# EAGLE design PCB-BI8-2x4_PCBAtest (EAGLE 6.5.0)

## Sheet 1 of 2
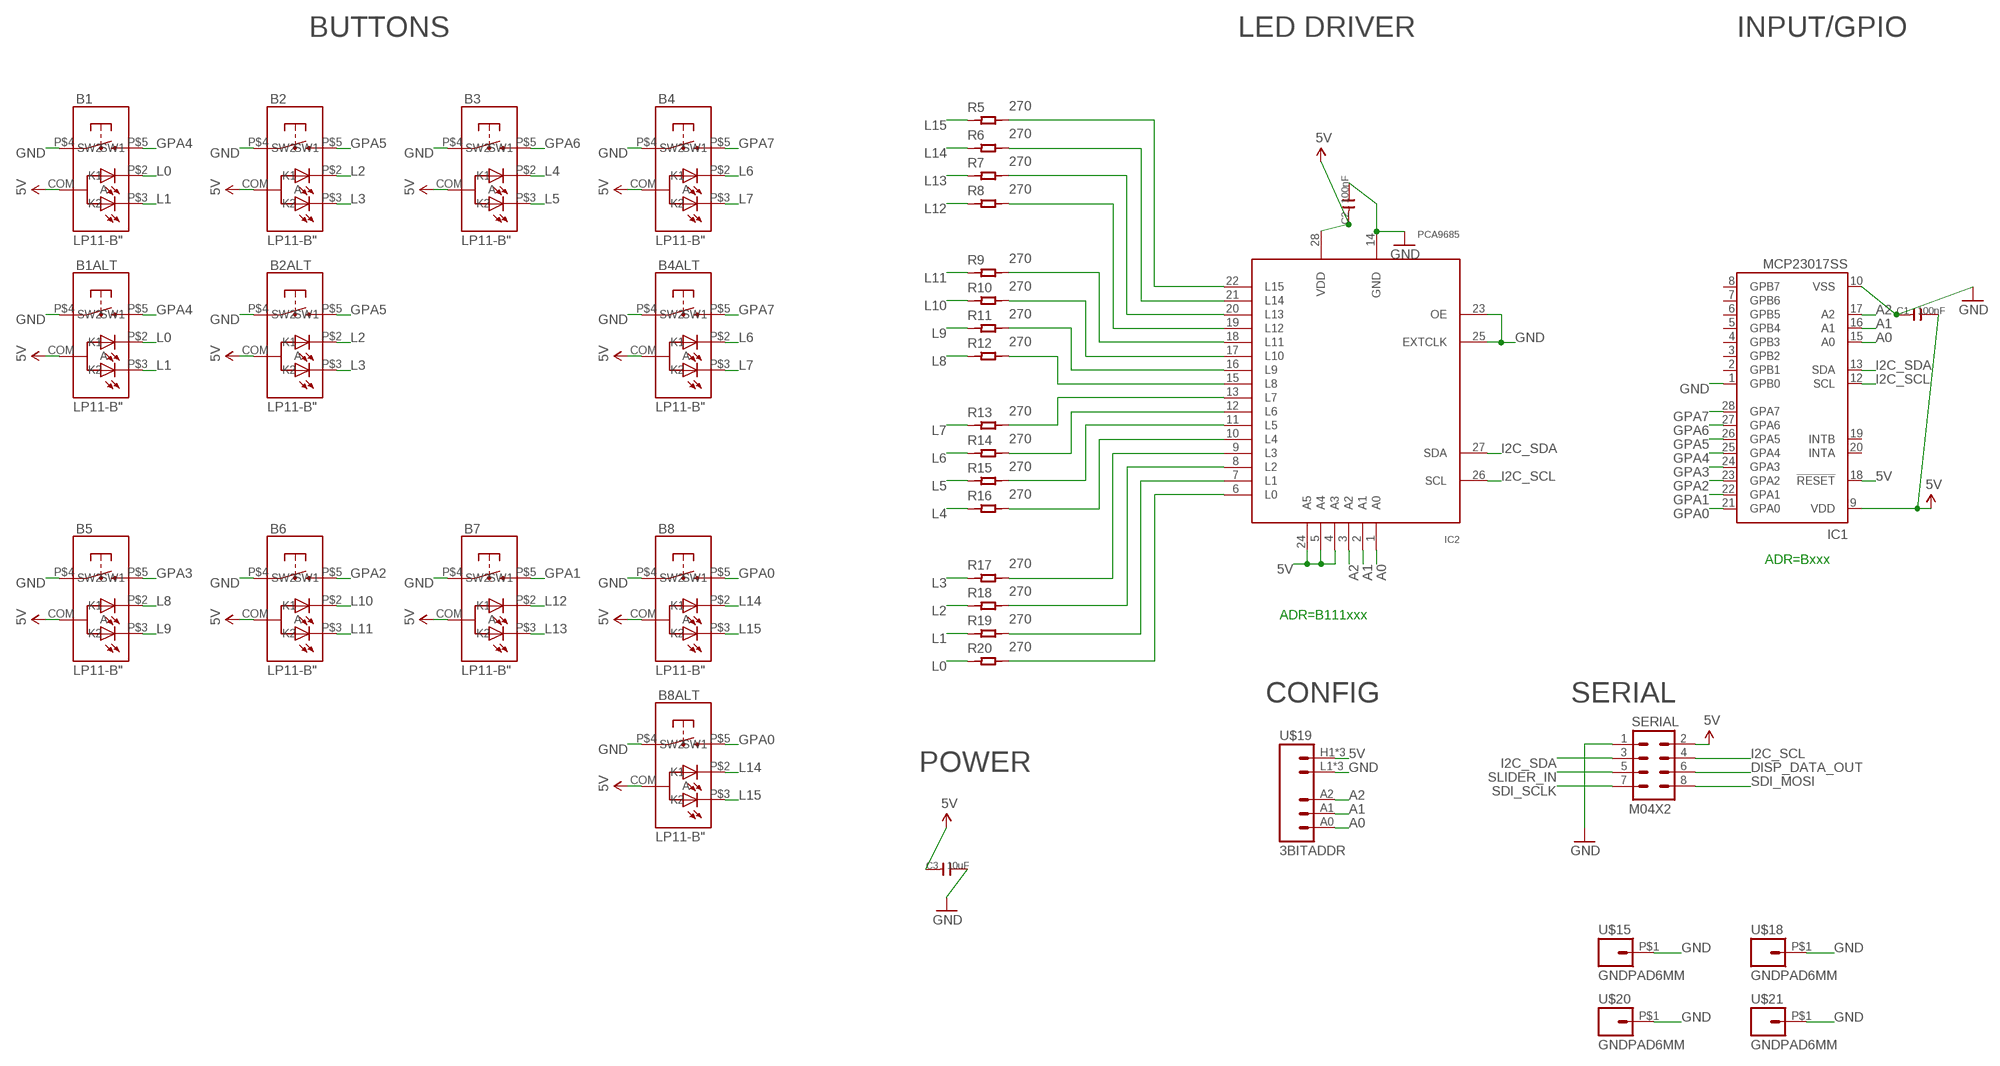
[diagram p0: schematic, sheet 1]

### Parts
B1  LP11-B"  [LP11]
B1ALT  LP11-B"  [LP11]
B2  LP11-B"  [LP11]
B2ALT  LP11-B"  [LP11]
B3  LP11-B"  [LP11]
B4  LP11-B"  [LP11]
B4ALT  LP11-B"  [LP11]
B5  LP11-B"  [LP11]
B6  LP11-B"  [LP11]
B7  LP11-B"  [LP11]
B8  LP11-B"  [LP11]
B8ALT  LP11-B"  [LP11]
C1  100nF  C-0603  [C0603]
C2  100nF  C-0603  [C0603]
C3  10uF  C-0805  [C0805]
IC1  MCP23017SS  [SSOP28]
IC2  PCA9685  [TSSOP28]
R5  270  R-0603  [R0603]
R6  270  R-0603  [R0603]
R7  270  R-0603  [R0603]
R8  270  R-0603  [R0603]
R9  270  R-0603  [R0603]
R10  270  R-0603  [R0603]
R11  270  R-0603  [R0603]
R12  270  R-0603  [R0603]
R13  270  R-0603  [R0603]
R14  270  R-0603  [R0603]
R15  270  R-0603  [R0603]
R16  270  R-0603  [R0603]
R17  270  R-0603  [R0603]
R18  270  R-0603  [R0603]
R19  270  R-0603  [R0603]
R20  270  R-0603  [R0603]
SERIAL  M04X2  [2X4]
U$15  GNDPAD6MM  [3.2MMPAD6MM]
U$18  GNDPAD6MM  [3.2MMPAD6MM]
U$19  3BITADDR  [3BITADDR]
U$20  GNDPAD6MM  [3.2MMPAD6MM]
U$21  GNDPAD6MM  [3.2MMPAD6MM]

### Nets
5V [Power]: B1.COM(A) B1ALT.COM(A) B2.COM(A) B2ALT.COM(A) B3.COM(A) B4.COM(A) B4ALT.COM(A) B5.COM(A) B6.COM(A) B7.COM(A) B8.COM(A) B8ALT.COM(A) C1.2 C2.1 C3.1 IC1.9(VDD) IC1.18(!RESET) IC2.4(A3) IC2.5(A4) IC2.24(A5) IC2.28(VDD) SERIAL.2 U$19.H1(VCC) U$19.H2(VCC) U$19.H3(VCC)
A0: IC1.15(A0) IC2.1(A0) U$19.A0
A1: IC1.16(A1) IC2.2(A1) U$19.A1
A2: IC1.17(A2) IC2.3(A2) U$19.A2
DISP_DATA_OUT: SERIAL.6
GND [Power]: B1.P$4(SW1) B1ALT.P$4(SW1) B2.P$4(SW1) B2ALT.P$4(SW1) B3.P$4(SW1) B4.P$4(SW1) B4ALT.P$4(SW1) B5.P$4(SW1) B6.P$4(SW1) B7.P$4(SW1) B8.P$4(SW1) B8ALT.P$4(SW1) C1.1 C2.2 C3.2 IC1.1(GPB0) IC1.10(VSS) IC2.14(GND) IC2.23(OE) IC2.25(EXTCLK) SERIAL.1 U$15.P$1 U$18.P$1 U$19.L1(GND) U$19.L2(GND) U$19.L3(GND) U$20.P$1 U$21.P$1
GPA0: B8.P$5(SW2) B8ALT.P$5(SW2) IC1.21(GPA0)
GPA1: B7.P$5(SW2) IC1.22(GPA1)
GPA2: B6.P$5(SW2) IC1.23(GPA2)
GPA3: B5.P$5(SW2) IC1.24(GPA3)
GPA4: B1.P$5(SW2) B1ALT.P$5(SW2) IC1.25(GPA4)
GPA5: B2.P$5(SW2) B2ALT.P$5(SW2) IC1.26(GPA5)
GPA6: B3.P$5(SW2) IC1.27(GPA6)
GPA7: B4.P$5(SW2) B4ALT.P$5(SW2) IC1.28(GPA7)
I2C_SCL: IC1.12(SCL) IC2.26(SCL) SERIAL.4
I2C_SDA: IC1.13(SDA) IC2.27(SDA) SERIAL.3
L0: B1.P$2(K1) B1ALT.P$2(K1) R20.1
L1: B1.P$3(K2) B1ALT.P$3(K2) R19.1
L2: B2.P$2(K1) B2ALT.P$2(K1) R18.1
L3: B2.P$3(K2) B2ALT.P$3(K2) R17.1
L4: B3.P$2(K1) R16.1
L5: B3.P$3(K2) R15.1
L6: B4.P$2(K1) B4ALT.P$2(K1) R14.1
L7: B4.P$3(K2) B4ALT.P$3(K2) R13.1
L8: B5.P$2(K1) R12.1
L9: B5.P$3(K2) R11.1
L10: B6.P$2(K1) R10.1
L11: B6.P$3(K2) R9.1
L12: B7.P$2(K1) R8.1
L13: B7.P$3(K2) R7.1
L14: B8.P$2(K1) B8ALT.P$2(K1) R6.1
L15: B8.P$3(K2) B8ALT.P$3(K2) R5.1
N$4: IC2.13(L7) R13.2
N$5: IC2.12(L6) R14.2
N$7: IC2.11(L5) R15.2
N$9: IC2.10(L4) R16.2
N$10: IC2.9(L3) R17.2
N$11: IC2.8(L2) R18.2
N$12: IC2.7(L1) R19.2
N$19: IC2.6(L0) R20.2
N$20: IC2.15(L8) R12.2
N$21: IC2.16(L9) R11.2
N$22: IC2.17(L10) R10.2
N$23: IC2.18(L11) R9.2
N$24: IC2.19(L12) R8.2
N$25: IC2.20(L13) R7.2
N$26: IC2.21(L14) R6.2
N$27: IC2.22(L15) R5.2
SDI_MOSI: SERIAL.8
SDI_SCLK: SERIAL.7
SLIDER_IN: SERIAL.5
Unconnected: IC1.2(GPB1) IC1.3(GPB2) IC1.4(GPB3) IC1.5(GPB4) IC1.6(GPB5) IC1.7(GPB6) IC1.8(GPB7) IC1.19(INTB) IC1.20(INTA)

### Notes on the sheet
- BUTTONS | LED DRIVER | INPUT/GPIO
- ADR=Bxxx
- ADR=B111xxx
- CONFIG | SERIAL
- POWER

## Sheet 2 of 2

## Library data of the parts
B1 B1ALT B2 B2ALT B3 B4 B4ALT B5-B8 B8ALT = SKAARHOJ:LP11-B
C1-C3 = OPL:C*
IC1 = microchip:MCP23017: http://ww1.microchip.com/downloads/en/DeviceDoc/21952a.pdf Source: http://ww1.microchip.com/downloads/en/DeviceDoc/21952a.pdf; MF: MICROCHIP; MPN: MCP23017-E/SS; OC_FARNELL: 1467674; OC_NEWARK: 31K2960
IC2 = wsmith:PCA9685
R5-R20 = OPL:R*
SERIAL = SparkFun:M04X2
U$15 U$18 U$20 U$21 = SKAARHOJ:GNDPAD
U$19 = SKAARHOJ:3BITADDR

## Net classes
0 default: width 0.203 mm, drill 0.406 mm, clearance 0.203 mm
1 Power: width 0.406 mm, drill 0.61 mm, clearance 0.203 mm

## Board
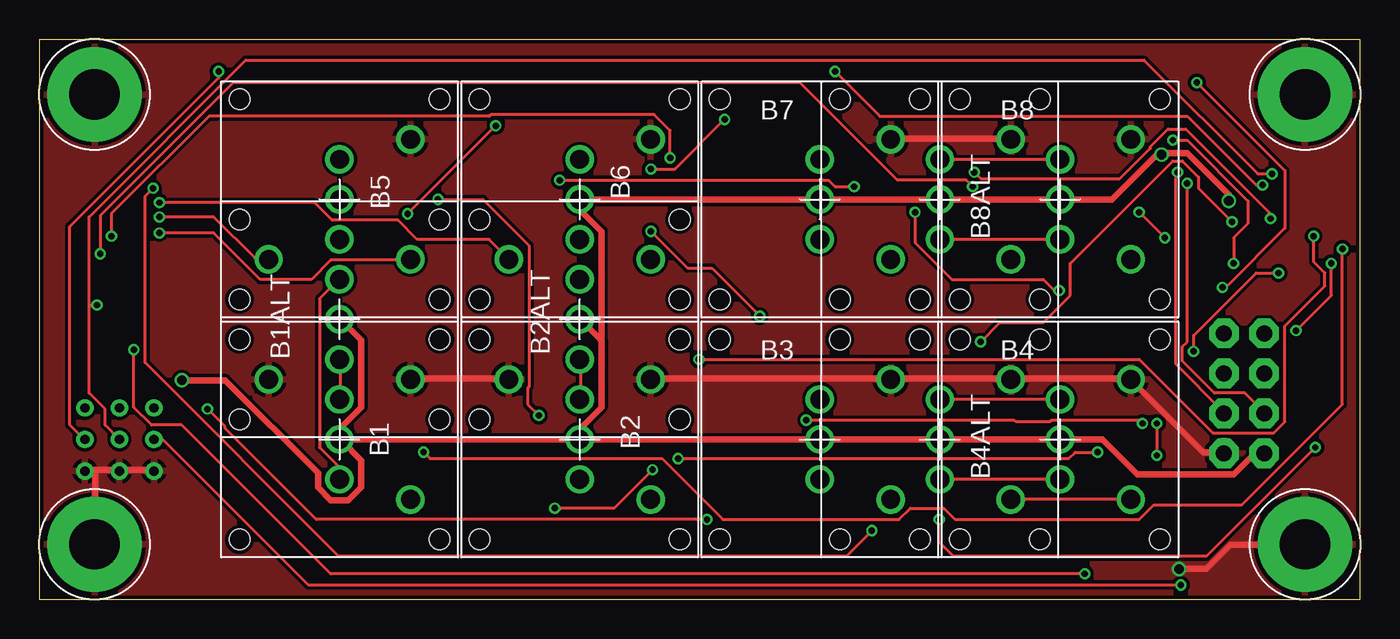
[diagram p1: board, top side]
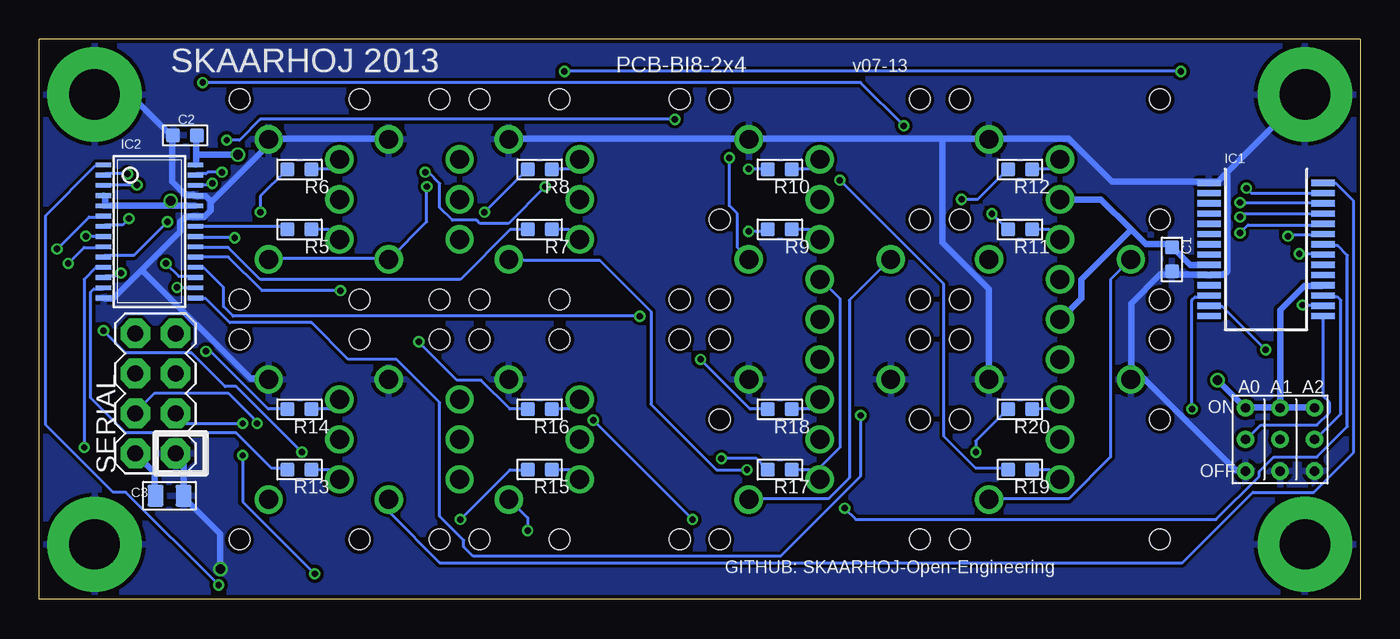
[diagram p2: board, bottom side, seen from below]

Size 83.82 x 35.56 mm. Coordinates in mm from the lower left corner, seen from the top.
Outline: 0,0 83.82,0 83.82,35.56 0,35.56 0,0
Copper layers (1*16): Top 0.035mm / dielectric 1.5mm / Bottom 0.035mm
Design rules "Fusion_eagle_rule_v1.1": minimum track width 6mil, minimum drill 12mil, track to track 6mil, track to pad 6mil, pad to pad 6mil, via to via 6mil, smd to smd 0mil, copper to edge 10mil, drill to drill 10mil, minimum pad ring 10mil, minimum via ring 6mil, stop-mask expansion 2mil, vias tented up to drill 100mil, thermal gap 10mil

### Footprints (pad centres in the part's own frame; a part is rotated, then mirrored left to right if it is on the bottom)
LP11 = drill 1.2: COM 0,0; P$2 0,2.54; P$3 0,-2.54; P$4 4.5,3.81; P$5 4.5,-3.81 | hole 1.3: -6.35,6.35; 6.35,6.35; 6.35,-6.35; -6.35,-6.35
C0603 = smd 0.889 x 0.889: 1 -0.762,0; 2 0.762,0
C0805 = smd 1.016 x 1.397: 1 -0.889,0; 2 0.889,0
SSOP28 = smd 0.4 x 1.5: 1 -4.225,-3.625; 2 -3.575,-3.625; 3 -2.925,-3.625; 4 -2.275,-3.625; 5 -1.625,-3.625; 6 -0.975,-3.625; 7 -0.325,-3.625; 8 0.325,-3.625; 9 0.975,-3.625; 10 1.625,-3.625; 11 2.275,-3.625; 12 2.925,-3.625; 13 3.575,-3.625; 14 4.225,-3.625; 15 4.225,3.625; 16 3.575,3.625; 17 2.925,3.625; 18 2.275,3.625; 19 1.625,3.625; 20 0.975,3.625; 21 0.325,3.625; 22 -0.325,3.625; 23 -0.975,3.625; 24 -1.625,3.625; 25 -2.275,3.625; 26 -2.925,3.625; 27 -3.575,3.625; 28 -4.225,3.625
TSSOP28 = smd 0.305 x 0.991: 1 -4.225,-2.918; 2 -3.575,-2.918; 3 -2.925,-2.918; 4 -2.275,-2.918; 5 -1.625,-2.918; 6 -0.975,-2.918; 7 -0.325,-2.918; 8 0.325,-2.918; 9 0.975,-2.918; 10 1.625,-2.918; 11 2.275,-2.918; 12 2.925,-2.918; 13 3.575,-2.918; 14 4.225,-2.918; 15 4.225,2.918; 16 3.575,2.918; 17 2.925,2.918; 18 2.275,2.918; 19 1.625,2.918; 20 0.975,2.918; 21 0.325,2.918; 22 -0.325,2.918; 23 -0.975,2.918; 24 -1.625,2.918; 25 -2.275,2.918; 26 -2.925,2.918; 27 -3.575,2.918; 28 -4.225,2.918
R0603 = smd 0.889 x 0.889: 1 -0.762,0; 2 0.762,0
2X4 = drill 1.016 pad 1.88 octagon: 1 -3.81,-1.27; 2 -3.81,1.27; 3 -1.27,-1.27; 4 -1.27,1.27; 5 1.27,-1.27; 6 1.27,1.27; 7 3.81,-1.27; 8 3.81,1.27
3.2MMPAD6MM = drill 3.2 pad 6: P$1 0,0
3BITADDR = drill 0.6: A0 -2.2,0; A1 0,0; A2 2.2,0; H1 -2.2,2; H2 0,2; H3 2.2,2; L1 -2.2,-2; L2 0,-2; L3 2.2,-2

### Placement (x,y rotation side)
B1  19.05,10.16 0 top
B1ALT  19.05,17.78 180 top
B2  34.29,10.16 0 top
B2ALT  34.29,17.78 180 top
B3  49.53,10.16 0 top
B4  64.77,10.16 0 top
B4ALT  57.15,10.16 0 top
B5  19.05,25.4 0 top
B6  34.29,25.4 0 top
B7  49.53,25.4 0 top
B8  64.77,25.4 0 top
B8ALT  57.15,25.4 0 top
C1  11.94,21.59 90 bottom
C2  74.57,29.46 180 bottom
C3  75.56,6.58 0 bottom
IC1  5.97,22.23 270 bottom
IC2  76.83,23.37 270 bottom
R5  67.31,23.5 180 bottom
R6  67.31,27.3 180 bottom
R7  52.07,23.5 180 bottom
R8  52.07,27.3 180 bottom
R9  36.83,23.5 180 bottom
R10  36.83,27.3 180 bottom
R11  21.59,23.5 180 bottom
R12  21.59,27.3 180 bottom
R13  67.31,8.26 180 bottom
R14  67.31,12.06 180 bottom
R15  52.07,8.26 180 bottom
R16  52.07,12.06 180 bottom
R17  36.83,8.26 180 bottom
R18  36.83,12.06 180 bottom
R19  21.59,8.26 180 bottom
R20  21.59,12.06 180 bottom
SERIAL  76.45,13.08 90 bottom
U$15  3.5,3.5 0 top
U$18  80.32,3.5 0 top
U$19  5.08,10.16 0 bottom
U$20  3.5,32.06 0 top
U$21  80.32,32.06 0 top

### Tracks (layer width: path | path; a pad name or v marks a point on that pad's centre or on a via)
5V  (via drill 0.61)
  Top 0.406: v75.49,25.3 75.49,25.7 72.85,28.35 71.32,28.35 v71.22,28.25 70.92,28.25 68.07,25.4 B8.COM B8ALT.COM B7.COM B6.COM 34.34,25.4 34.34,24.69 35.66,23.37 35.66,16.66 35.56,16.56 | SERIAL.2 77.72,9.25 77.11,9.25 75.79,7.92 69.7,7.92 67.46,10.16 B4.COM B4ALT.COM B3.COM B2.COM | 35.56,16.56 34.34,17.78 B2ALT.COM | 35.56,16.56 35.66,16.46 35.66,12.19 34.34,10.87 34.34,10.16 B2.COM | B1.COM 19.1,10.16 19.1,10.87 20.42,12.19 20.42,16.46 19.1,17.78 B1ALT.COM | v9.04,13.92 11.79,13.92 17.68,8.03 17.68,7.11 18.49,6.3 19.61,6.3 20.42,7.11 20.42,8.84 19.2,10.06 B1.COM | B1.COM B2.COM
  Bottom 0.406: 79.65,24.99 75.49,24.99 | 75.49,24.99 73.97,24.99 IC2.24 | 79.65,24.99 IC2.5 | 79.65,24.99 79.65,25.6 IC2.4 | 73.86,28.25 73.86,29.36 73.76,29.46 C2.1 | 73.86,28.25 73.86,27.64 IC2.28 | v71.22,28.25 73.86,28.25 | v75.49,25.3 75.49,24.99 | U$19.H2 5.08,18.39 3.56,19.91 2.44,19.91 IC1.18 | U$19.H3 2.95,12.19 4.98,12.19 U$19.H2 | U$19.H2 5.28,12.19 7.21,12.19 U$19.H1 7.42,12.29 v9.04,13.92 | 14.53,23.47 16.46,25.4 B5.COM | 14.53,23.47 13.61,22.55 11.99,22.55 C1.2 11.79,22.25 10.77,21.23 9.65,21.23 IC1.9 | 14.53,23.47 17.68,20.32 17.68,19.1 19,17.78 B1ALT.COM | C3.1 76.5,6.6 76.5,8.03 77.72,9.25 SERIAL.2
A0  (via drill 0.41)
  Top 0.203: v72.44,0.91 17.07,0.91 7.82,10.16 U$19.A0
  Bottom 0.203: IC1.15 2.34,17.98 2.34,12.9 1.93,12.5 1.93,11.89 2.74,11.07 6.3,11.07 7.21,10.16 U$19.A0 | v72.44,0.91 78.33,6.81 79.15,6.81 83.41,11.07 83.41,24.38 80.26,27.53 79.76,27.53 IC2.1
A1  (via drill 0.41)
  Top 0.203: v78.23,27.03 77.32,27.03 70.1,34.24 13.11,34.24 3.15,24.28 3.15,18.69 | 3.15,18.69 3.15,13.11 4.17,12.09 4.17,11.07 U$19.A1 | 3.15,18.69 v3.66,18.69
  Bottom 0.203: v78.23,27.03 79.65,27.03 IC2.2 | v3.66,18.69 2.44,18.69 IC1.16
A2  (via drill 0.41)
  Top 0.203: v77.62,26.31 77.22,26.31 72.85,30.68 53.34,30.68 v50.49,33.53 | v11.38,33.53 11.38,33.12 1.93,23.67 1.93,11.07 2.85,10.16 U$19.A2
  Bottom 0.203: v77.62,26.31 79.65,26.31 IC2.3 | v11.38,33.53 v50.49,33.53 | IC1.17 2.34,19.2 1.42,19.2 1.22,19 1.22,11.79 2.85,10.16 U$19.A2
GND  (via drill 0.61)
  Top 0.406: B2.P$4 38.81,14.02 53.95,14.02 B3.P$4 54.15,14.02 61.57,14.02 B4ALT.P$4 61.77,14.02 69.19,14.02 B4.P$4 69.39,13.82 73.86,9.35 75.18,9.35 SERIAL.1 | 3.56,8.23 5.08,8.23 U$19.L2 5.18,8.23 7.21,8.23 U$19.L1 | 3.56,8.23 2.95,8.23 U$19.L3 | 3.56,8.23 3.56,3.56 U$15.P$1 | B1.P$4 23.57,14.02 29.77,14.02 B2ALT.P$4 | B7.P$4 54.05,29.26 61.57,29.26 B8ALT.P$4 | v72.34,1.93 74.07,1.93 75.59,3.45 80.26,3.45 U$18.P$1
  Bottom 0.406: U$20.P$1 8.53,27.03 | 8.53,27.03 9.04,26.52 9.55,26.52 IC1.1 9.75,26.52 15.75,26.52 18.49,29.26 23.37,29.26 B5.P$4 23.57,29.26 26.52,29.26 | 8.53,27.03 8.43,26.92 8.43,20.83 8.64,20.62 9.45,20.62 IC1.10 9.75,20.62 11.79,20.62 C1.1 11.99,20.62 12.7,20.62 14.53,18.8 14.53,14.02 B1ALT.P$4 14.43,14.73 7.92,8.23 7.32,8.23 U$19.L1 | 26.52,29.26 38.71,29.26 B6.P$4 38.91,29.26 53.95,29.26 B7.P$4 | 26.52,29.26 26.52,22.66 23.57,19.71 23.57,14.02 B1.P$4 | 72.95,25.3 72.95,24.69 73.36,24.28 73.86,24.28 IC2.23 74.07,24.28 74.57,24.28 74.88,23.98 74.88,23.37 77.32,20.93 | 72.95,25.3 73.25,25.6 73.86,25.6 IC2.25 74.07,25.7 74.57,25.7 75.39,26.52 75.39,29.46 C2.2 75.59,29.57 78.03,32 80.26,32 U$21.P$1 | 77.32,20.93 79.15,19.1 79.65,19.1 IC2.14 | 72.95,25.3 72.85,25.3 69.29,28.85 69.29,29.16 B8.P$4 69.09,29.26 61.67,29.26 B8ALT.P$4 | 77.32,20.93 70.41,14.02 69.29,14.02 B4.P$4 | SERIAL.1 75.18,9.25 74.68,8.74 C3.2 74.57,6.4 72.34,4.17 v72.34,1.93
  pour Top: 0,0 83.82,0 83.82,35.56 0,35.56
  pour Bottom: 0,0 83.82,0 83.82,35.56 0,35.56
GPA0  (via drill 0.41)
  Top 0.203: v3.86,21.95 3.86,24.38 12.29,32.82 48.26,32.82 54.46,26.62 58.83,26.62 v59.23,26.21
  Bottom 0.203: v3.86,21.95 2.44,21.95 IC1.21 | v59.23,26.21 59.23,23.98 61.57,21.64 B8ALT.P$5 61.67,21.64 69.19,21.64 B8.P$5
GPA1  (via drill 0.41)
  Top 0.203: v32.72,5.79 36.47,5.79 v38.91,8.23
  Bottom 0.203: v32.72,5.79 32,5.08 9.14,5.08 6.4,7.82 6.4,8.13 5.49,9.04 2.74,9.04 0.81,10.97 0.81,21.84 1.42,22.45 2.34,22.45 IC1.22 | v38.91,8.23 40.84,8.23 45.01,12.39 45.01,18.29 48.26,21.54 53.95,21.54 B7.P$5
GPA2  (via drill 0.41)
  Top 0.203: v4.57,23.06 4.57,24.49 10.77,30.68 28.55,30.68 28.65,30.79 39.01,30.79 40.03,29.77 v40.03,28.04
  Bottom 0.203: v4.57,23.06 4.47,23.16 2.44,23.16 IC1.23 | v40.03,28.04 40.03,24.99 39.52,24.49 39.52,22.35 38.81,21.64 B6.P$5
GPA3  (via drill 0.41)
  Top 0.203: v7.62,23.27 11.07,23.27 14.02,20.32 17.27,20.32 18.49,21.54 23.47,21.54 B5.P$5
  Bottom 0.203: v7.62,23.27 7.11,23.77 2.44,23.77 IC1.24
GPA4  (via drill 0.41)
  Top 0.203: v7.62,24.28 11.07,24.28 13.72,21.64 14.53,21.64 B1ALT.P$5
  Bottom 0.203: v7.62,24.28 7.42,24.49 2.44,24.49 IC1.25 | B1.P$5 23.47,6.4 18.49,6.4 15.85,9.04 15.85,20.32 14.63,21.54 B1ALT.P$5
GPA5  (via drill 0.41)
  Top 0.203: v7.62,25.2 17.48,25.2 18.59,24.08 22.76,24.08 23.98,22.86 28.55,22.86 29.77,21.64 B2ALT.P$5
  Bottom 0.203: v7.62,25.2 2.44,25.2 IC1.26 | B2.P$5 38.71,6.4 33.73,6.4 32.41,7.72 32.41,19 29.87,21.54 B2ALT.P$5
GPA6  (via drill 0.41)
  Top 0.203: v7.21,26.11 6.71,25.6 6.71,15.04 19,2.74 51.21,2.74 v52.83,4.37
  Bottom 0.203: v7.21,26.11 6.91,25.81 2.44,25.81 IC1.27 | v52.83,4.37 52.83,5.18 53.95,6.3 B3.P$5
GPA7
  Top 0.203: B4.P$5 69.19,6.4 61.67,6.4 B4ALT.P$5
  Bottom 0.203: IC1.28 2.34,26.42 1.52,26.42 0.41,25.3 0.41,9.35 2.95,6.81 6.81,6.81 11.28,2.34 58.42,2.34 61.57,5.49 61.57,6.3 B4ALT.P$5
I2C_SCL  (via drill 0.41)
  Top 0.203: v72.85,26.42 72.85,16.36 72.54,16.05 72.54,15.14 74.57,13.11 76.5,13.11 77.72,11.89 SERIAL.4 | v10.67,12.09 11.79,10.97 11.79,10.87 17.58,5.08 v42.37,5.08 | v48.67,11.38 61.87,11.38 61.98,11.28 64.11,11.28 64.21,11.38 69.8,11.38 v70,11.18
  Bottom 0.203: v72.85,26.42 72.95,26.31 73.86,26.31 IC2.26 | v10.67,12.09 10.67,19 10.46,19.2 9.65,19.2 IC1.12 | v48.67,11.38 v42.37,5.08 | v70,11.18 70.21,11.38 70.21,11.48 71.83,13.11 76.5,13.11 77.72,11.89 SERIAL.4
I2C_SDA  (via drill 0.41)
  Top 0.203: v72.24,27.13 72.24,26.82 72.14,26.72 72.14,14.94 75.18,11.89 SERIAL.3 | v5.99,15.85 5.99,12.19 7.11,11.07 9.04,11.07 18.49,1.63 v66.34,1.63 | v70.92,11.18 v70.92,9.14
  Bottom 0.203: v72.24,27.13 73.15,27.13 73.25,27.03 73.86,27.03 IC2.27 | v5.99,15.85 8.74,18.59 9.55,18.59 IC1.13 | v66.34,1.63 70.92,6.2 v70.92,9.14 | v70.92,11.18 74.57,11.18 75.18,11.79 SERIAL.3
L0
  Top 0.203: B1.P$2 19.1,12.7 19.1,15.24 B1ALT.P$2
  Bottom 0.203: R20.1 20.73,12.09 19.71,12.09 19.1,12.7 B1.P$2
L1
  Top 0.203: B1.P$3 19,7.62 19,8.43 17.78,9.65 17.78,19.1 19,20.32 B1ALT.P$3
  Bottom 0.203: R19.1 20.73,8.23 19.71,8.23 19.1,7.62 B1.P$3
L2
  Top 0.203: B2.P$2 34.34,12.7 34.34,15.24 B2ALT.P$2
  Bottom 0.203: R18.1 35.97,12.09 34.95,12.09 34.34,12.7 B2.P$2
L3
  Bottom 0.203: R17.1 35.97,8.23 34.95,8.23 34.34,7.62 B2.P$3 34.65,8.03 33.02,9.65 33.02,19.1 34.24,20.32 B2ALT.P$3
L4
  Bottom 0.203: R16.1 51.21,12.09 50.19,12.09 49.58,12.7 B3.P$2
L5
  Bottom 0.203: R15.1 51.21,8.23 50.19,8.23 49.58,7.62 B3.P$3
L6
  Top 0.203: B4.P$2 B4ALT.P$2
  Bottom 0.203: R14.1 66.45,12.09 65.43,12.09 64.82,12.7 B4.P$2
L7
  Top 0.203: B4.P$3 B4ALT.P$3
  Bottom 0.203: R13.1 66.45,8.23 65.43,8.23 64.82,7.62 B4.P$3
L8
  Bottom 0.203: R12.1 20.73,27.33 19.71,27.33 19.1,27.94 B5.P$2
L9
  Bottom 0.203: R11.1 20.73,23.47 19.71,23.47 19.1,22.86 B5.P$3
L10
  Bottom 0.203: R10.1 35.97,27.33 34.95,27.33 34.34,27.94 B6.P$2
L11
  Bottom 0.203: R9.1 35.97,23.47 34.95,23.47 34.34,22.86 B6.P$3
L12
  Bottom 0.203: R8.1 51.21,27.33 50.19,27.33 49.58,27.94 B7.P$2
L13
  Bottom 0.203: R7.1 51.21,23.47 50.19,23.47 49.58,22.86 B7.P$3
L14
  Top 0.203: B8.P$2 B8ALT.P$2
  Bottom 0.203: R6.1 66.45,27.33 65.43,27.33 64.82,27.94 B8.P$2
L15
  Top 0.203: B8.P$3 B8ALT.P$3
  Bottom 0.203: R5.1 66.45,23.47 65.43,23.47 64.82,22.86 B8.P$3
N$4
  Bottom 0.203: IC2.13 79.76,19.71 80.37,19.71 80.57,19.51 80.57,12.8 78.33,10.57 71.32,10.57 69.09,8.33 68.17,8.33 R13.2
N$5  (via drill 0.41)
  Top 0.203: v78.64,20.73 77.22,20.73 73.25,16.76 v73.25,15.75
  Bottom 0.203: v78.64,20.73 78.84,20.52 79.65,20.52 IC2.12 | v73.25,15.75 72.95,15.75 69.29,12.09 68.17,12.09 R14.2
N$7  (via drill 0.41)
  Top 0.203: v57.1,5.08 57.1,3.66 58.01,2.74 74.07,2.74 v80.97,9.65
  Bottom 0.203: v57.1,5.08 53.95,8.23 52.83,8.23 R15.2 | v80.97,9.65 80.97,20.32 80.26,21.03 79.76,21.03 IC2.11
N$9  (via drill 0.41)
  Top 0.203: v75.69,23.98 73.56,26.11 73.56,26.82 72.54,27.84 71.93,27.84 65.43,21.34 65.43,19.3 63.7,17.58 60.96,17.58 v59.74,16.36
  Bottom 0.203: v75.69,23.98 77.83,21.84 79.65,21.84 IC2.10 | v59.74,16.36 57.3,13.92 55.78,13.92 53.95,12.09 52.93,12.09 R16.2
N$10  (via drill 0.41)
  Top 0.203: v81.99,21.34 81.99,19.3 v79.76,17.07 | v67.16,9.35 65.73,9.35 65.33,8.94 v40.54,8.94
  Bottom 0.203: v81.99,21.34 80.97,22.35 79.76,22.35 IC2.9 | v79.76,17.07 78.33,15.65 74.17,15.65 72.03,13.51 71.32,13.51 v67.16,9.35 | v40.54,8.94 38.3,8.94 37.69,8.33 R17.2
N$11  (via drill 0.41)
  Top 0.203: v80.87,23.06 80.87,21.44 81.58,20.73 81.58,19.91 79.05,17.37 79.05,11.28 78.33,10.57 74.47,10.57 69.8,15.24 v41.86,15.24
  Bottom 0.203: v80.87,23.06 79.76,23.06 IC2.8 | v41.86,15.24 38.71,12.09 37.69,12.09 R18.2
N$12  (via drill 0.41)
  Top 0.203: v78.13,24.18 78.13,24.49 72.75,29.87 71.63,29.87 70.51,28.75 70.51,28.65 68.58,26.72 59.74,26.72 v59.33,27.13 | v51.71,26.21 50.49,26.21 50.09,26.62 v33.02,26.62
  Bottom 0.203: v78.13,24.18 78.54,23.77 79.65,23.77 IC2.7 | v59.33,27.13 59.13,27.13 58.42,26.42 58.42,24.89 57.61,24.08 56.08,24.08 55.88,23.88 54.05,23.88 v51.71,26.21 | v33.02,26.62 26.42,20.02 26.42,10.36 24.38,8.33 22.45,8.33 R19.2
N$19  (via drill 0.41)
  Top 0.203: v82.7,22.25 82.7,12.39 76.3,5.99 70.71,5.99 69.8,5.08 58.12,5.08 57.4,5.79 55.27,5.79 54.56,5.08 43.38,5.08 39.52,8.94 24.79,8.94 v24.38,9.35
  Bottom 0.203: v82.7,22.25 80.67,24.28 79.76,24.28 IC2.6 | v24.38,9.35 24.38,10.06 22.45,11.99 R20.2
N$20  (via drill 0.41)
  Top 0.203: v31.7,11.68 30.99,12.39 30.99,13.41 31.09,13.51 31.09,22.45 28.14,25.4 v25.3,25.4
  Bottom 0.203: v31.7,11.68 31.7,7.82 36.78,2.74 56.29,2.74 56.9,3.35 56.9,3.76 58.42,5.28 58.42,12.5 61.16,15.24 64.21,15.24 66.55,17.58 71.73,17.58 73.25,19.1 73.86,19.1 IC2.15 | v25.3,25.4 24.28,25.4 22.45,27.23 R12.2
N$21  (via drill 0.41)
  Top 0.203: v75.08,19.81 75.29,19.81 79.05,23.57 79.05,27.23 v73.46,32.82 | v23.37,24.49 v28.96,30.07
  Bottom 0.203: v75.08,19.81 73.97,19.81 IC2.16 | v73.46,32.82 31.7,32.82 v28.96,30.07 | v23.37,24.49 22.45,23.57 R11.2
N$22  (via drill 0.41)
  Top 0.203: v75.79,21.34 75.79,22.96 76.71,23.88 76.71,25.3 72.85,29.16 v71.93,29.16 | v43.48,30.48 40.34,27.33 v38.81,27.33
  Bottom 0.203: v75.79,21.34 74.98,20.52 73.97,20.52 IC2.17 | v71.93,29.16 71.12,29.16 69.8,30.48 v43.48,30.48 | v38.81,27.33 37.69,27.33 R10.2
N$23  (via drill 0.41)
  Top 0.203: v45.72,17.98 42.67,21.03 41.15,21.03 v38.81,23.37
  Bottom 0.203: v45.72,17.98 71.53,17.98 72.14,18.59 72.14,19.81 73.36,21.03 73.86,21.03 IC2.18 | v38.81,23.37 37.8,23.37 37.69,23.47 R9.2
N$24  (via drill 0.41)
  Top 0.203: v64.72,19.61 64.41,19.61 63.7,20.32 57.91,20.32 55.58,22.66 v55.58,24.59
  Bottom 0.203: v64.72,19.61 69.7,19.61 71.83,21.74 73.86,21.74 IC2.19 | v55.58,24.59 52.93,27.23 R8.2
N$25
  Bottom 0.203: IC2.20 73.86,22.35 71.83,22.35 69.8,20.32 57.1,20.32 53.95,23.47 52.93,23.47 R7.2
N$26  (via drill 0.41)
  Top 0.203: v69.8,24.59 v71.42,22.96
  Bottom 0.203: v71.42,22.96 73.86,22.96 IC2.21 | v69.8,24.59 69.8,25.6 68.17,27.23 R6.2
N$27
  Bottom 0.203: IC2.22 73.86,23.67 68.28,23.67 68.17,23.57 R5.2

### Text on the board
_bsilk: v07-13 | PCB-BI8-2x4 | SKAARHOJ 2013 | GITHUB: SKAARHOJ-Open-Engineering